# Altium schematic sheet ProbeAmp.SchDoc
size 406 x 304 mm; SheetNumber: 3; SheetTotal: 8
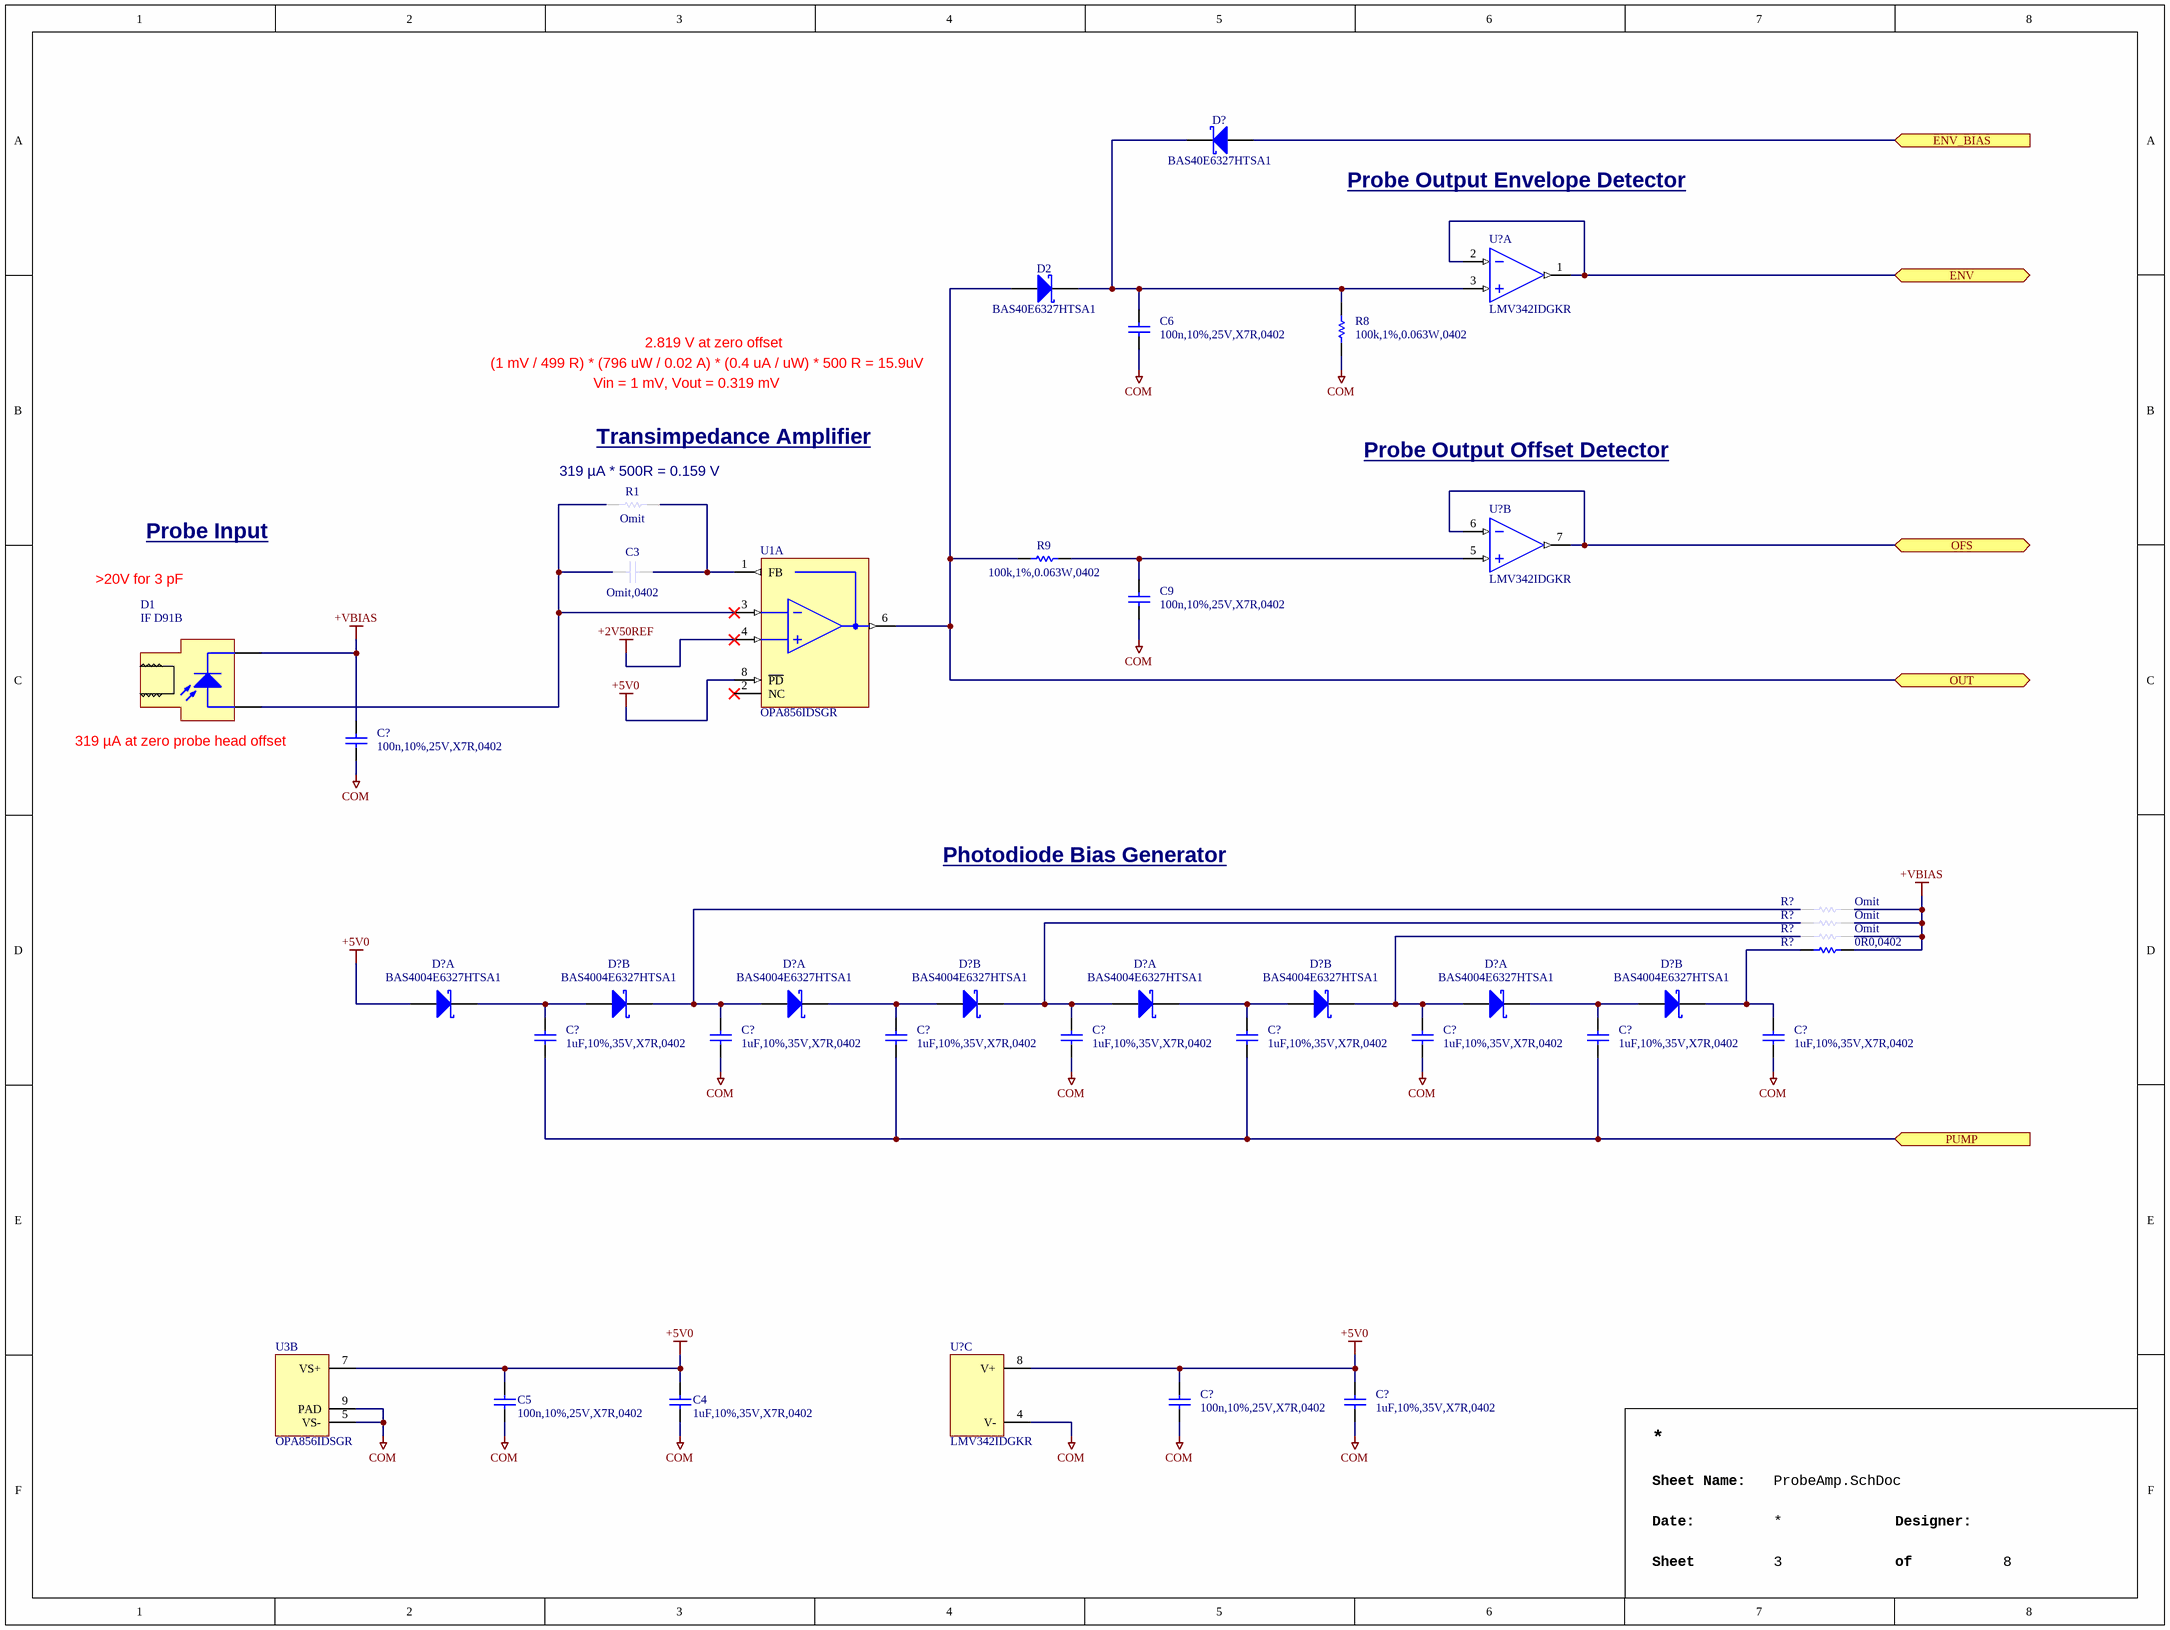
[diagram p0: ProbeAmp.SchDoc]

## Parts
(Parts that share a designator on the sheet are numbered #1, #2 ... from top to bottom, then left to right.)
C3  Omit,0402  [CAPC1005X06N]  (no BOM)
C4  1uF,10%,35V,X7R,0402  [CAPC1005X06N]
C5  100n,10%,25V,X7R,0402  [CAPC1005X06N]
C6  100n,10%,25V,X7R,0402  [CAPC1005X06N]
C9  100n,10%,25V,X7R,0402  [CAPC1005X06N]
C?#1  100n,10%,25V,X7R,0402  [CAPC1005X06N]
C?#2  1uF,10%,35V,X7R,0402  [CAPC1005X06N]
C?#3  1uF,10%,35V,X7R,0402  [CAPC1005X06N]
C?#4  1uF,10%,35V,X7R,0402  [CAPC1005X06N]
C?#5  1uF,10%,35V,X7R,0402  [CAPC1005X06N]
C?#6  1uF,10%,35V,X7R,0402  [CAPC1005X06N]
C?#7  1uF,10%,35V,X7R,0402  [CAPC1005X06N]
C?#8  1uF,10%,35V,X7R,0402  [CAPC1005X06N]
C?#9  1uF,10%,35V,X7R,0402  [CAPC1005X06N]
C?#10  100n,10%,25V,X7R,0402  [CAPC1005X06N]
C?#11  1uF,10%,35V,X7R,0402  [CAPC1005X06N]
D1  IF D91B  [INDUSTRIALFIBEROPTICS_IF-D91B]
D2  BAS40E6327HTSA1  [INFINEON_PKG_SOT23]
D?#1  BAS40E6327HTSA1  [INFINEON_PKG_SOT23]
D?#2  BAS4004E6327HTSA1  [INFINEON_PKG_SOT23]  (part A of 2)
D?#3  BAS4004E6327HTSA1  [INFINEON_PKG_SOT23]  (part B of 2)
D?#4  BAS4004E6327HTSA1  [INFINEON_PKG_SOT23]  (part A of 2)
D?#5  BAS4004E6327HTSA1  [INFINEON_PKG_SOT23]  (part B of 2)
D?#6  BAS4004E6327HTSA1  [INFINEON_PKG_SOT23]  (part A of 2)
D?#7  BAS4004E6327HTSA1  [INFINEON_PKG_SOT23]  (part B of 2)
D?#8  BAS4004E6327HTSA1  [INFINEON_PKG_SOT23]  (part A of 2)
D?#9  BAS4004E6327HTSA1  [INFINEON_PKG_SOT23]  (part B of 2)
R1  Omit  [RESC1005X04N]  (no BOM)
R8  100k,1%,0.063W,0402  [RESC1005X04N]
R9  100k,1%,0.063W,0402  [RESC1005X04N]
R?#1  Omit  [RESC1005X04N]  (no BOM)
R?#2  Omit  [RESC1005X04N]  (no BOM)
R?#3  Omit  [RESC1005X04N]  (no BOM)
R?#4  0R0,0402  [RESC1005X04N]
U1  OPA856IDSGR  [TEXASINSTRUMENTS_PKG_DSG0008A]  (part A of 2)
U3  OPA856IDSGR  [TEXASINSTRUMENTS_PKG_DSG0008A]  (part B of 2)
U?#1  LMV342IDGKR  [TEXASINSTRUMENTS_PKG_DGK0008A]  (part A of 3)
U?#2  LMV342IDGKR  [TEXASINSTRUMENTS_PKG_DGK0008A]  (part B of 3)
U?#3  LMV342IDGKR  [TEXASINSTRUMENTS_PKG_DGK0008A]  (part C of 3)

## Ports
ENV (bidir), ENV_BIAS (in), OFS (bidir), OUT (bidir), PUMP (in)

## Nets
+2V50REF: U1.4(IN+)
+5V0: C4.2 C5.2 C?#10.2 C?#11.2 D?#2.1(A) U1.8(~{PD}) U3.7(VS+) U?#3.8(V+)
+VBIAS: C?#1.2 D1.2(K) R?#1.2 R?#2.2 R?#3.2 R?#4.1
COM: C4.1 C5.1 C6.1 C9.1 C?#1.1 C?#3.1 C?#5.1 C?#7.1 C?#9.1 C?#10.1 C?#11.1 R8.1 U3.5(VS-) U3.9(PAD) U?#3.4(V-)
ENV: U?#1.1(1OUT) U?#1.2(1IN-) ; port ENV
ENV_BIAS: D?#1.1(A) ; port ENV_BIAS
OFS: U?#2.6(2IN+) U?#2.7(2OUT) ; port OFS
OUT: D2.1(A) R9.2 U1.6(OUT) ; port OUT
PUMP: C?#2.1 C?#4.1 C?#6.1 C?#8.1 ; port PUMP
NetC3_1: C3.1 D1.1(A) R1.1 U1.3(IN-)
NetC3_2: C3.2 R1.2 U1.1(FB)
NetC6_2: C6.2 D2.3(K) D?#1.3(K) R8.2 U?#1.3(1IN+)
NetC9_2: C9.2 R9.1 U?#2.5(2IN-)
NetC?#2_2: C?#2.2 D?#2.3(K) D?#3.1(A)
NetC?#3_2: C?#3.2 D?#3.3(K) D?#4.1(A) R?#1.1
NetC?#4_2: C?#4.2 D?#4.3(K) D?#5.1(A)
NetC?#5_2: C?#5.2 D?#5.3(K) D?#6.1(A) R?#2.1
NetC?#6_2: C?#6.2 D?#6.3(K) D?#7.1(A)
NetC?#7_2: C?#7.2 D?#7.3(K) D?#8.1(A) R?#3.1
NetC?#8_2: C?#8.2 D?#8.3(K) D?#9.1(A)
NetC?#9_2: C?#9.2 D?#9.3(K) R?#4.2

Not connected (* = marked no-connect by the designer): U1 2(NC)*

## Notes on the sheet
- Probe Output Envelope Detector
- (1 mV / 499 R) * (796 uW / 0.02 A) * (0.4 uA / uW) * 500 R = 15.9uV
- 2.819 V at zero offset
- Vin = 1 mV, Vout = 0.319 mV
- (near R1) 319 µA * 500R = 0.159 V
- Transimpedance Amplifier
- Probe Output Offset Detector
- >20V for 3 pF
- Probe Input
- (near D1) 319 µA at zero probe head offset
- Photodiode Bias Generator
- Sheet Name:
- Date:
- Sheet
- Designer:
- of

## Library data of the parts
C3 = CAP,Omit,0402: Omit; Part Name: CAP,Omit,0402; CreatedBy: Judd Foster; HelpURL: N/A; Manufacturer 1: N/A; Manufacturer 1 Part Number: N/A; Vendor 1: N/A; Vendor 1 Part Number: N/A; Value: Omit
C4 C?#2-C?#9 C?#11 = CAP,Cer,1uF,35VDC,X5R,0402: 1 ï¿½F ï¿½10% 35V Ceramic Capacitor X5R 0402 (1005 Metric); Manufacturer 1: TDK Corporation; Manufacturer 1 Part Number: C1005X5R1V105K050BC; Vendor 1 Part Number: 445-9073-1-ND; Vendor 1: Digikey; Value: 1u; Part Name: CAP,Cer,1uF,35VDC,X5R,0402; CreatedBy: Judd Foster; HelpURL: https://product.tdk.com/info/en/catalog/datasheets/mlcc_commercial_general_en.pdf?ref_disty=digikey
C5 C6 C9 C?#1 C?#10 = CAP,Cer,100nF,10%,25V,X7R,0402: 0.1ï¿½F ï¿½10% 25V Ceramic Capacitor X7R 0402 (1005 Metric); Manufacturer 1: Murata Electronics; Manufacturer 1 Part Number: GRM155R71E104KE14J; Vendor 1 Part Number: 490-14603-1-ND; Vendor 1: DigiKey; Value: 100nF; Part Name: CAP,Cer,100nF,10%,25V,X7R,0402; CreatedBy: Judd Foster; HelpURL: https://search.murata.co.jp/Ceramy/image/img/A01X/G101/ENG/GRM155R71E104KE14-01.pdf
D1 = RECEIVER,FIBER OPTIC,450-1050NM,IF-D91B: Fiber Optic Receiver General Purpose 100Mbps; Manufacturer 1: Industrial Fiber Optics; Vendor 1 Part Number: FB200-ND; Vendor 1: DigiKey; Part Name: RECEIVER,FIBER OPTIC,450-1050NM,IF-D91B; CreatedBy: Judd Foster; HelpURL: https://i-fiberoptics.com/pdf/ifd91b-1809.pdf; Manufacturer 1 Part Number: IF D91B
D2 D?#1 = Diode,Schottky,40V,1A,SOT23: Diode 40 V 120mA Surface Mount PG-SOT23; Manufacturer 1: Infineon Technologies; Vendor 1 Part Number: BAS40E6327HTSA1CT-ND; Vendor 1: DigiKey; Part Name: Diode,Schottky,40V,1A,SOT23; CreatedBy: Judd Foster; HelpURL: https://rocelec.widen.net/view/pdf/ukzfofyli6/INFNS19700-1.pdf?t.download=true&u=5oefqw; Manufacturer 1 Part Number: BAS40E6327HTSA1
D?#2-D?#9 = DIODE,Array,Schottky,Series,40V,120mA,SOT23: Diode Array 1 Pair Series Connection 40 V 120mA (DC) Surface Mount TO-236-3, SC-59, SOT-23-3; Manufacturer 1: Infineon Technologies; Vendor 1 Part Number: BAS4004E6327HTSA1CT-ND; Vendor 1: DigiKey; Part Name: DIODE,Array,Schottky,Series,40V,120mA,SOT23; CreatedBy: Judd Foster; HelpURL: https://rocelec.widen.net/view/pdf/ukzfofyli6/INFNS19700-1.pdf?t.download=true&u=5oefqw; Manufacturer 1 Part Number: BAS4004E6327HTSA1
R1 R?#1-R?#3 = RES,Omit,0402: Part Name: RES,Omit,0402; CreatedBy: Judd Foster; HelpURL: N/A; Manufacturer 1: N/A; Manufacturer 1 Part Number: N/A; Vendor 1: N/A; Vendor 1 Part Number: N/A; Value: Omit
R8 R9 = RES,100k,1%,0.063W,0402: 100 kOhms Â±1% 0.063W, 1/16W Chip Resistor 0402 (1005 Metric) Moisture Resistant Thick Film; Manufacturer 1: YAGEO; Manufacturer 1 Part Number: RC0402FR-07100KL; Vendor 1 Part Number: 311-100KLRCT-ND; Vendor 1: DigiKey; Part Name: RES,100k,1%,0.063W,0402; CreatedBy: Judd Foster; HelpURL: https://www.yageo.com/upload/media/product/products/datasheet/rchip/PYu-RC_Group_51_RoHS_L_12.pdf; Value: 100k
R?#4 = RES,0R0,0402: 0 Ohms Jumper 0.1W, 1/10W Chip Resistor 0402 (1005 Metric) Automotive AEC-Q200 Thick Film; Manufacturer 1: Panasonic Electronic Components; Manufacturer 1 Part Number: ERJ-2GE0R00X; Vendor 1 Part Number: P0.0JCT-ND; Vendor 1: Digikey; Value: 0R; Part Name: RES,0R0,0402; CreatedBy: Judd Foster; HelpURL: https://industrial.panasonic.com/cdbs/www-data/pdf/RDA0000/AOA0000C301.pdf
U1 U3 = OPA856IDSGR: General Purpose Amplifier 1 Circuit Rail-to-Rail 8-WSON (2x2); Manufacturer 1: Texas Instruments; Vendor 1 Part Number: 296-OPA856IDSGRCT-ND; Vendor 1: DigiKey; Part Name: OPA856IDSGR; CreatedBy: Judd Foster; HelpURL: https://www.ti.com/lit/ds/symlink/opa856.pdf?HQS=dis-dk-null-digikeymode-dsf-pf-null-wwe&ts=1736226484393; Manufacturer 1 Part Number: OPA856IDSGR
U?#1-U?#3 = LMV342IDGKR: CMOS Amplifier 2 Circuit Rail-to-Rail 8-VSSOP; Manufacturer 1: Texas Instruments; Vendor 1 Part Number: 296-22012-1-ND; Vendor 1: DigiKey; Part Name: LMV342IDGKR; CreatedBy: Judd Foster; HelpURL: https://www.ti.com/lit/ds/symlink/lmv341.pdf?HQS=dis-dk-null-digikeymode-dsf-pf-null-wwe&ts=1738729278639&ref_url=https%253A%252F%252Fwww.ti.com%252Fgeneral%252Fdocs%252Fsuppproductinfo.tsp%253FdistId%253D10%2526gotoUrl%253Dhttps%253A%252F%252Fwww.ti.com%; Manufacturer 1 Part Number: LMV342IDGKR